# Altium schematic sheet AD7793.schdoc
size 419 x 299 mm; SheetNumber: 1; SheetTotal: 2
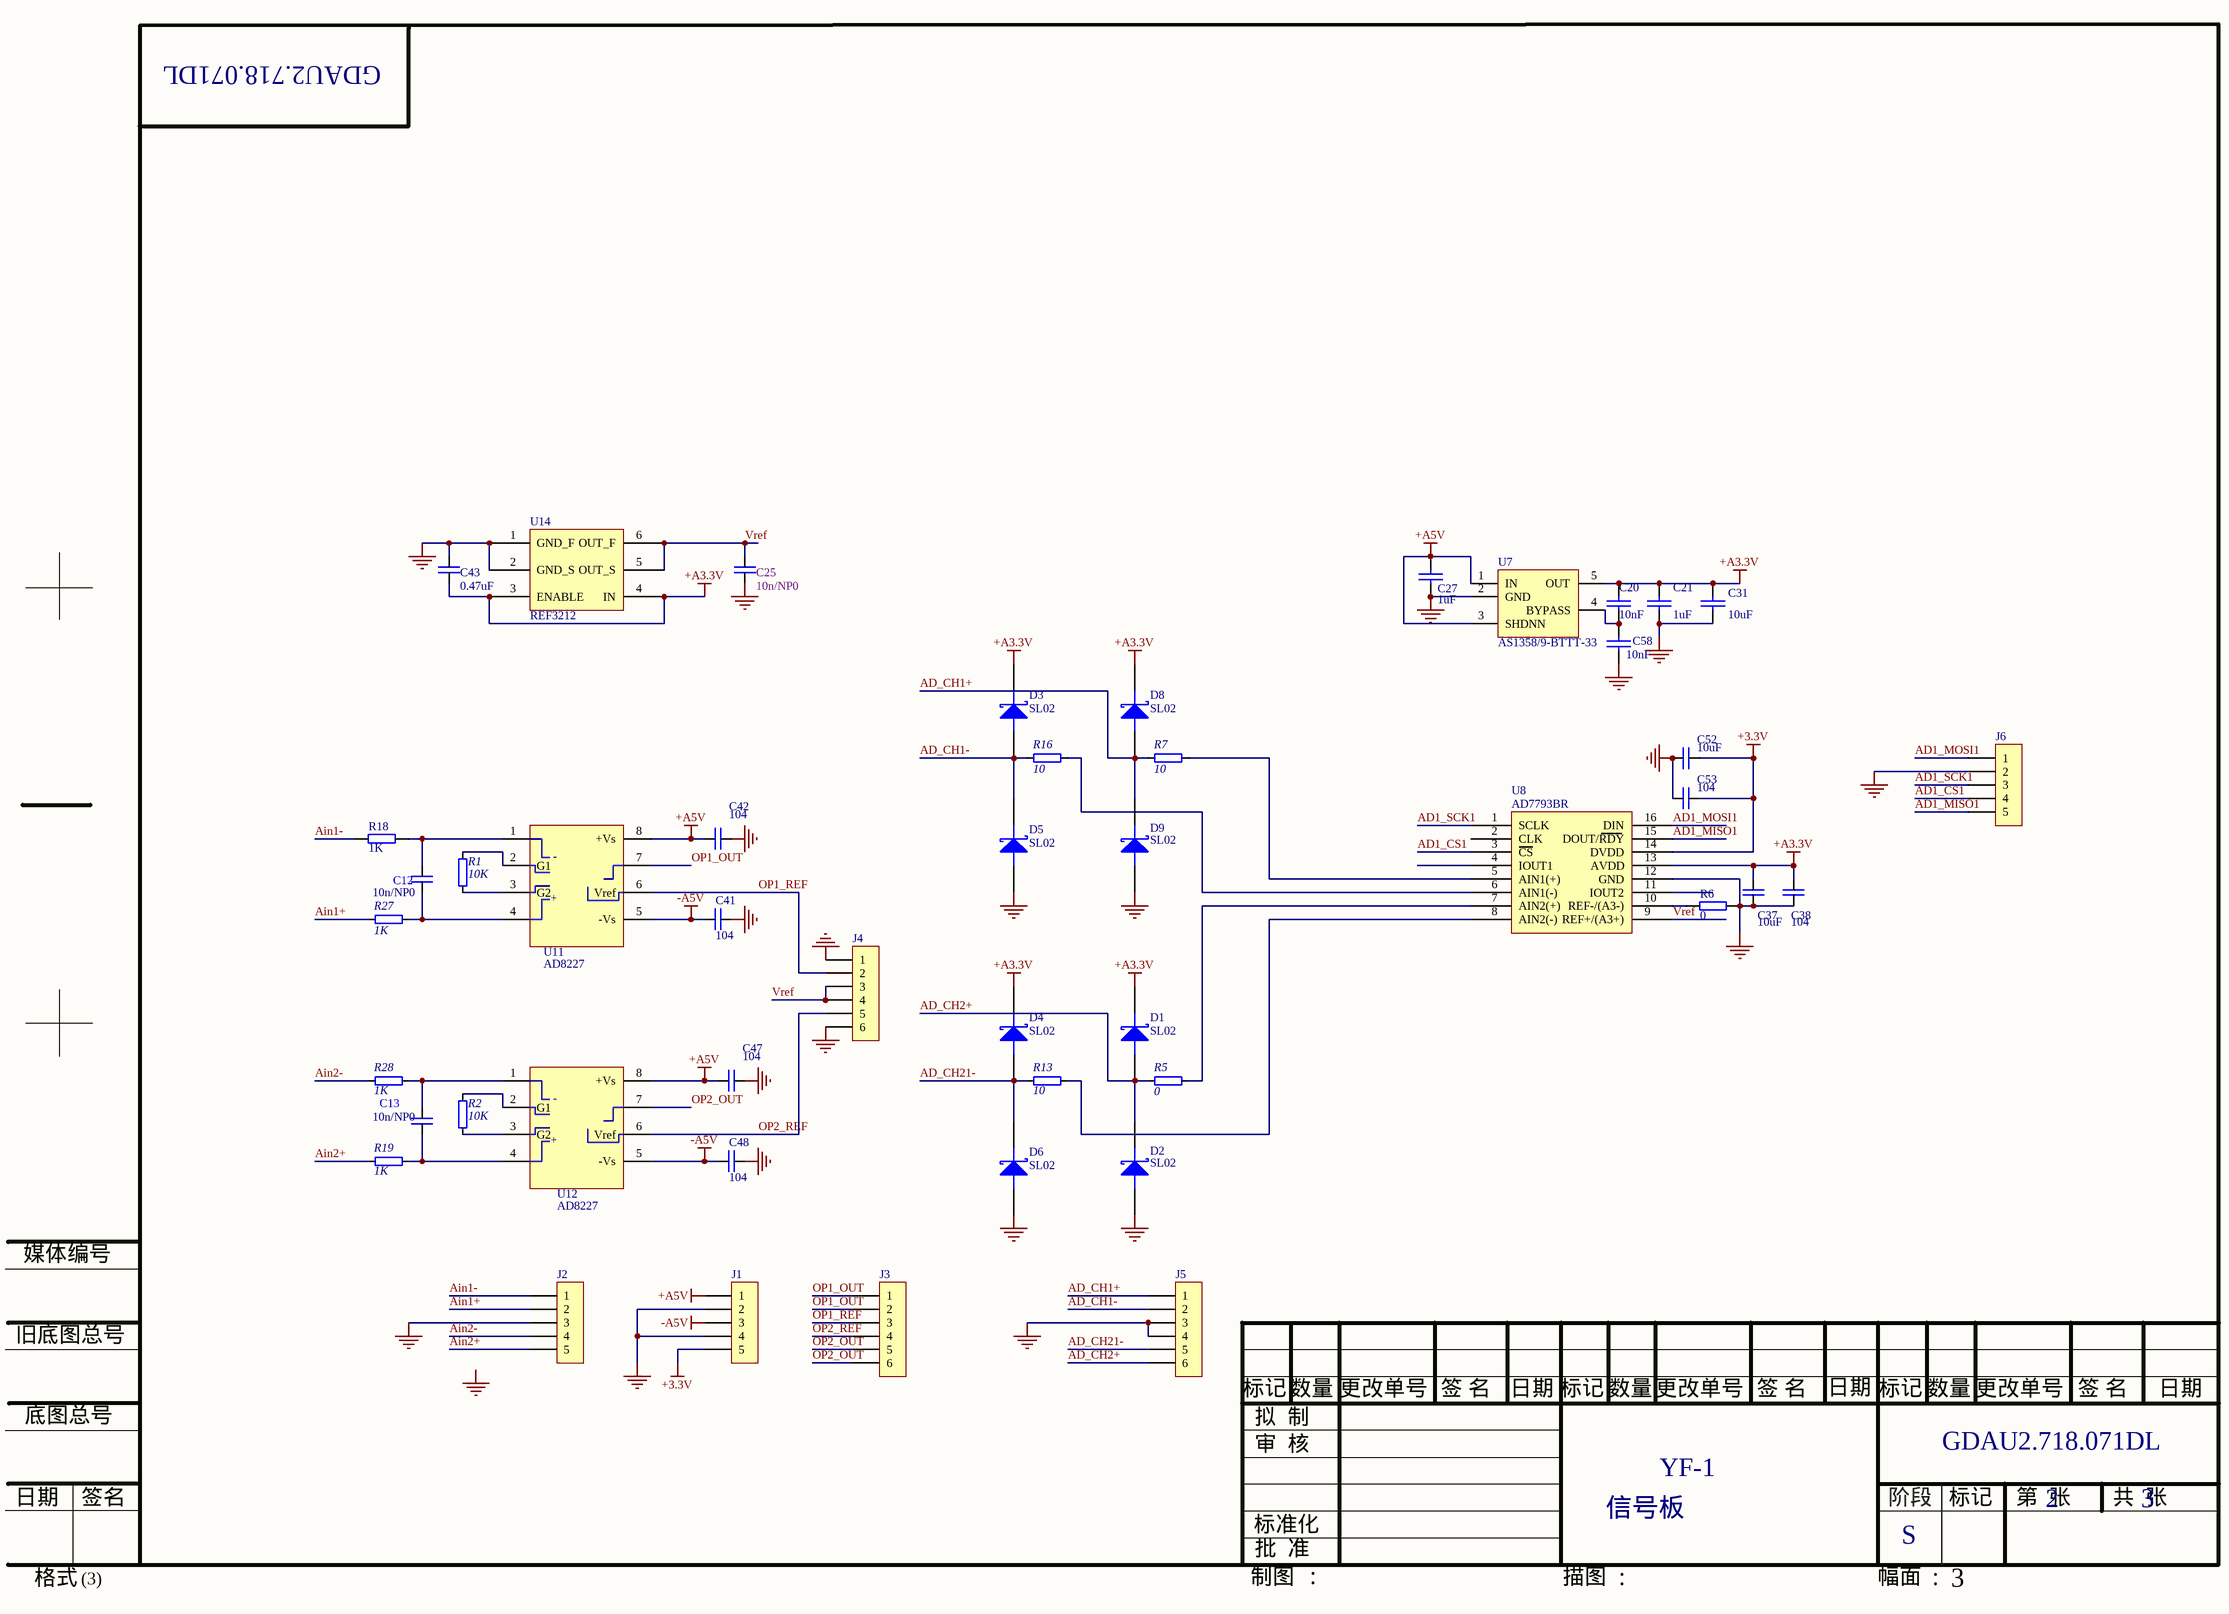
[diagram p0: AD7793.schdoc]

## Parts
C12  10n/NP0  [0805]
C13  10n/NP0  [0805]
C20  10nF  [0603]
C21  1uF  [0603]
C25  10n/NP0  [0805]
C27  1uF  [0603]
C31  10uF  [0805]
C37  10uF  [0805]
C38  104  [0603]
C41  104  [0603]
C42  104  [0603]
C43  0.47uF  [0603]
C47  104  [0603]
C48  104  [0603]
C52  10uF  [0805]
C53  104  [0603]
C58  10nF  [0603]
D1  SL02  [DO-219AB]
D2  SL02  [DO-219AB]
D3  SL02  [DO-219AB]
D4  SL02  [DO-219AB]
D5  SL02  [DO-219AB]
D6  SL02  [DO-219AB]
D8  SL02  [DO-219AB]
D9  SL02  [DO-219AB]
J1  (no value)  [SIP5]
J2  (no value)  [SIP5]
J3  (no value)  [SIP6]
J4  (no value)  [SIP6]
J5  (no value)  [SIP6]
J6  (no value)  [SIP5]
R1  10K  [0603]
R2  10K  [0603]
R5  0  [0603]
R6  0  [0603]
R7  10  [0603]
R13  10  [0603]
R16  10  [0603]
R18  1K  [0603]
R19  1K  [0603]
R27  1K  [0603]
R28  1K  [0603]
U7  AS1358/9-BTTT-33  [SOT23-5]
U8  AD7793BR  [TSSOP-16]
U11  AD8227  [S8]
U12  AD8227  [S8]
U14  REF3212  [SOT-23(6)]

## Nets
+3.3V: C52.2 C53.2 J1.5 U8.14(DVDD)
+A3.3V: C20.2 C21.2 C31.1 C37.2 C38.2 C43.1 D1.K D3.K D4.K D8.K U7.5(OUT) U8.13(AVDD) U14.3(ENABLE) U14.4(IN)
+A5V: C27.1 C42.1 C47.1 J1.1 U7.1(IN) U7.3(SHDNN) U11.8(+Vs) U12.8(+Vs)
-A5V: C41.2 C48.2 J1.3 U11.5(-Vs) U12.5(-Vs)
GND: C21.1 C25.1 C27.2 C31.2 C37.1 C38.1 C41.1 C42.2 C43.2 C47.2 C48.1 C52.1 C53.1 C58.1 D2.A D5.A D6.A D9.A J1.2 J1.4 J2.3 J4.1 J4.6 J5.3 J5.4 J6.2 R6.1 U7.2(GND) U8.12(GND) U14.1(GND_F) U14.2(GND_S)
AD1_CS1: J6.4 U8.3(CS)
AD1_MISO1: J6.5 U8.15(DOUT/RDY)
AD1_MOSI1: J6.1 U8.16(DIN)
AD1_SCK1: J6.3 U8.1(SCLK)
AD_CH1+: D8.A D9.K J5.1 R7.1
AD_CH1-: D3.A D5.K J5.2 R16.1
AD_CH2+: D1.A D2.K J5.6 R5.2
AD_CH21-: D4.A D6.K J5.5 R13.2
Ain1+: J2.2 R27.1
Ain1-: J2.1 R18.1
Ain2+: J2.5 R19.1
Ain2-: J2.4 R28.1
OP1_OUT: J3.1 J3.2 U11.7
OP1_REF: J3.3 J4.2 U11.6(Vref)
OP2_OUT: J3.5 J3.6 U12.7
OP2_REF: J3.4 J4.5 U12.6(Vref)
Vref: C25.2 J4.3 J4.4 U8.9(REF+/(A3+)) U14.5(OUT_S) U14.6(OUT_F)
NetC12_1: C12.1 R27.2 U11.4
NetC12_2: C12.2 R18.2 U11.1
NetC13_1: C13.1 R28.2 U12.1
NetC13_2: C13.2 R19.2 U12.4
NetC20_1: C20.1 C58.2 U7.4(BYPASS)
NetR1_1: R1.1 U11.2(G1)
NetR1_2: R1.2 U11.3(G2)
NetR2_1: R2.1 U12.2(G1)
NetR2_2: R2.2 U12.3(G2)
NetR5_1: R5.1 U8.7(AIN2(+))
NetR6_2: R6.2 U8.10(REF-/(A3-))
NetR7_2: R7.2 U8.5(AIN1(+))
NetR13_1: R13.1 U8.8(AIN2(-))
NetR16_2: R16.2 U8.6(AIN1(-))

Not connected (* = marked no-connect by the designer): U8 2(CLK) 4(IOUT1) 11(IOUT2)

## Notes on the sheet
- GDAU2.718.071DL
- YF-1
- 信号板
- S
- 2
- 3
- Labels drawn without touching a wire or pin: GND
- 媒体编号
- 旧底图总号
- 标记
- 数量
- 更改单号
- 签 名
- 日期
- 底图总号
- 拟  制
- 审  核
- 签名
- 标准化
- 阶段
- 第  张
- 共  张
- 格式
- (3)
- 制图
- 批  准
- ：
- 描图
- 幅面
- (in symbol AD8228) -; +

## Library data of the parts
C12 C13 C25 C37 C38 C41-C43 C47 C48 C52 C53 = 贴片电容
C20 C21 C27 C31 C58 = CAP: Capacitor
D1-D6 D8 D9 = DIODE SCHOTTKY: Schottky Diode
J1 J2 J6 = CON5: Connector
J3-J5 = CON6: Connector
R1 R2 R5 R7 R13 R16 R19 R27 R28 = RES2
R6 R18 = 贴片电阻(回流焊)
U7 = 稳压器AS1358/9: AS1358/9
U8 = AD7793
U11 U12 = AD8228: INA282